# Altium project Wuerfel.PrjPcb
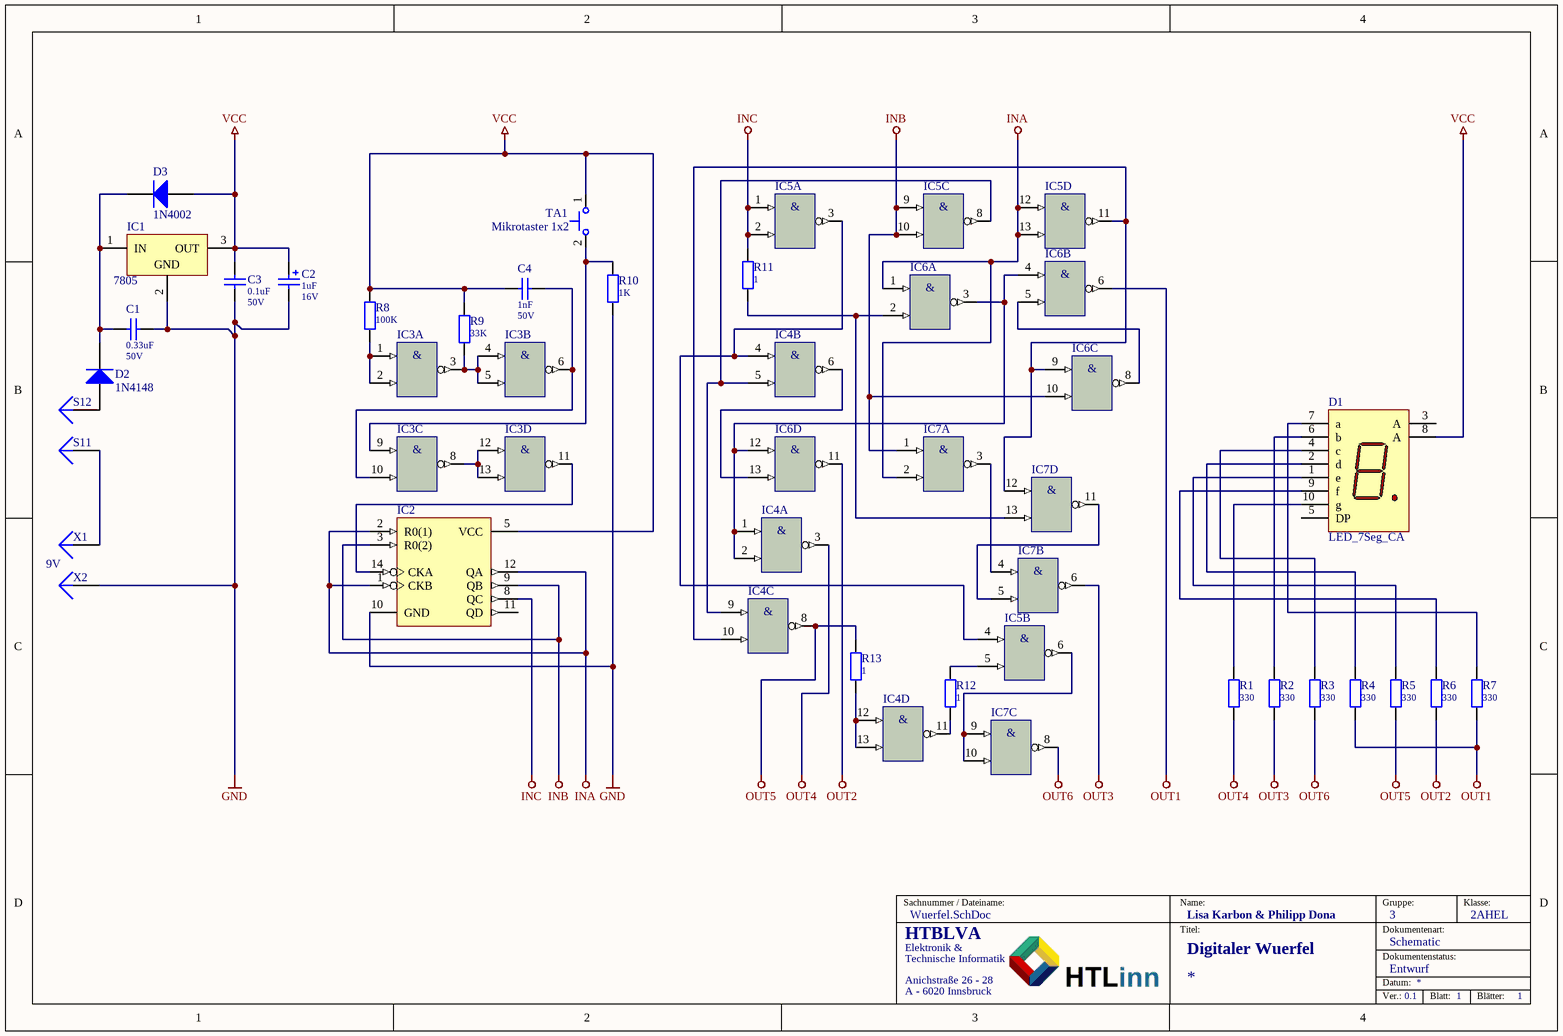
[diagram p0: Wuerfel.SchDoc]
1 sheet, 32 parts. Net scope: global (net labels, ports and power ports of the same name join across sheets).
Board file: Wuerfel.PcbDoc

## Sheet Wuerfel.SchDoc
size A4; DocumentNumber: 1; Revision: 0.1; SheetNumber: 1; SheetTotal: 1; HTL_Gruppe: 3; HTL_Klasse: 2AHEL; HTL_Schueler_Name: Lisa Karbon & Philipp Dona; PageSetup: Record=PageOptions|CenterHorizontal=True|CenterVertical=True|PrintScale=1.00|XCorrection=1.00|YCorrection=1.00|PrintKind=0|BorderSize=5000000|LeftOffset=0|BottomOffset=0|Orientation=2|PaperLength=1000|PaperWidth=1000|Scale=100|PaperSource=7|PrintQuality=-4|MediaType=1|DitherType=10|PaperKind=A4|PrintScaleMode=1; HTL_Projektname: Digitaler Wuerfel; HTL_Dokumentenart: Schematic; HTL_Dokumentenstatus: Entwurf; SPICEModelCacheRWURBHBP: <root> / <DocumentId>RWURBHBP</DocumentId> / <CacheFrame Number="0"> / <Model Name="1n4148w" Kind="MDL"> / <Text>******************************************************************************************************* / * / *                (c)  2009 Diodes Incorporated / * / *   The copyright in these models  and  the designs embodied belong / *   to Diodes Incorporated (" Diodes ").  They  are  supplied / *   free of charge by Diodes for the purpose of research and design / *   and may be used or copied intact  (including this notice)  for / *   that purpose only.  All other rights are reserved. The models / *   are believed accurate but  no condition  or warranty  as to their / *   merchantability or fitness for purpose is given and no liability / *   in respect of any use is accepted by Diodes Incorporated, its distributors / *   or agents. / * / *   Diodes Incorporated, 1566 N. Dallas Parkway, Suite 850, Dallas, TX 75248, USA / * / *************************************************************************************************************************************** / *SRC=1N4148W;1N4148W;Diodes;Si;  75.0V  0.300A  4.00ns   Diodes Inc. / .MODEL 1N4148W D  ( IS=10.4n RS=51.5m BV=75.0 IBV=1.00u / + CJO=2.00p  M=0.333 N=2.07 TT=5.76n )</Text> / </Model> / <Model Name="sn74ls93" Kind="MDL"> / <Text>*Texas Instruments / *SN74LS93: 4-Bit Binary Counter / .MODEL SN74LS93 xsimcode(file="{MODEL_PATH}LS.SCB" func=ls93 {mntymx})</Text> / </Model> / <Model Name="sn74ls00" Kind="MDL"> / <Text>*Texas Instruments / *SN74LS00: LS 2-in NAND / .MODEL SN74LS00 xsimcode(file="{MODEL_PATH}LS.SCB" func=ls00 {mntymx})</Text> / </Model> / <Model Name="di_1n4002" Kind="MDL"> / <Text>*************************************************************************************************************************************** / *SRC=1N4002;DI_1N4002;Diodes;Si;  100V  1.00A  3.00us   Diodes, Inc. diode / .MODEL DI_1N4002 D  ( IS=76.9p RS=42.0m BV=100 IBV=5.00u / + CJO=39.8p  M=0.333 N=1.45 TT=4.32u )</Text> / </Model> / </CacheFrame> / </root>

### Parts
C1  Rated Voltage: 50V  [C_RM2-025X075]  (hidden comment: 0.33uF)
C2  Rated Voltage: 16V  [C_POL_RM2-8,5]  (hidden comment: 1uF)
C3  Rated Voltage: 50V  [C_RM2-025X075]  (hidden comment: 0.1uF)
C4  Rated Voltage: 50V  [C_RM2-025X075]  (hidden comment: 1nF)
D1  LED_7Seg_CA  [LED_7Seg]
D2  1N4148  [D_DO35-RM3]
D3  1N4002  [D_DO41-RM4]
IC1  7805  [TO-220]
IC2  SN74LS93  [DIP14]  (value not drawn)
IC3  SN74LS00  [DIP14]  (value not drawn)  (parts A,B,C,D of 4)
IC4  SN74LS00  [DIP14]  (value not drawn)  (parts A,B,C,D of 4)
IC5  SN74LS00  [DIP14]  (value not drawn)  (parts A,B,C,D of 4)
IC6  SN74LS00  [DIP14]  (value not drawn)  (parts A,B,C,D of 4)
IC7  SN74LS00  [DIP14]  (value not drawn)  (parts A,B,C,D of 4)
R1  330  [R_0207/RM4]
R2  330  [R_0207/RM4]
R3  330  [R_0207/RM4]
R4  330  [R_0207/RM4]
R5  330  [R_0207/RM4]
R6  330  [R_0207/RM4]
R7  330  [R_0207/RM4]
R8  value 100K  [R_0207/RM4]  (hidden comment: 68K)
R9  33K  [R_0207/RM4]
R10  1K  [R_0207/RM4]
R11  1  [R_0207/RM4]
R12  1  [R_0207/RM4]
R13  1  [R_0207/RM4]
S11  Plug  [PIN1]  (value not drawn)
S12  Plug  [PIN1]  (value not drawn)
TA1  Mikrotaster 1x2  [SW_DTSM-61NT/R - 1x2]
X1  Plug  [PIN1]  (value not drawn)
X2  Plug  [PIN1]  (value not drawn)

### Nets
GND: C1.1 C2.2(-) C3.2 IC1.2(GND) IC2.10(GND) IC3.7(GND) IC4.7(GND) IC5.7(GND) IC6.7(GND) IC7.7(GND) R10.1 X2.1
INA: IC2.1(CKB) IC2.2(R0(1)) IC2.12(QA) IC5.12(A) IC5.13(B) IC6.1(A) IC7.2(B)
INB: IC2.3(R0(2)) IC2.9(QB) IC5.9(A) IC5.10(B) IC6.10(B) IC7.1(A)
INC: IC2.8(QC) IC5.1(A) IC5.2(B) R11.2
OUT1: IC6.6(Y) R4.1 R7.1
OUT2: IC6.11(Y) R6.1
OUT3: IC7.6(Y) R2.1
OUT4: IC4.3(Y) R1.1
OUT5: IC4.8(Y) R5.1 R13.2
OUT6: IC7.8(Y) R3.1
VCC: C2.1(+) C3.1 C4.1 D1.8(A) D3.A IC1.3(OUT) IC2.5(VCC) IC3.14(VCC) IC4.14(VCC) IC5.14(VCC) IC6.14(VCC) IC7.14(VCC) R8.1 R9.1 TA1.1
NetC1_2: C1.2 D2.C(K) D3.C(K) IC1.1(IN)
NetC4_2: C4.2 IC3.6(Y) IC3.10(B)
NetD1_1: D1.1(e) R5.2
NetD1_2: D1.2(d) R4.2
NetD1_4: D1.4(c) R3.2
NetD1_6: D1.6(b) R2.2
NetD1_7: D1.7(a) R7.2
NetD1_9: D1.9(f) R6.2
NetD1_10: D1.10(g) R1.2
NetD2_A: D2.A S12.1
NetIC2_14: IC2.14(CKA) IC3.11(Y)
NetIC3_1: IC3.1(A) IC3.2(B) R8.2
NetIC3_3: IC3.3(Y) IC3.4(A) IC3.5(B) R9.2
NetIC3_8: IC3.8(Y) IC3.12(A) IC3.13(B)
NetIC3_9: IC3.9(A) R10.2 TA1.2
NetIC4_1: IC4.1(A) IC4.2(B) IC6.3(Y) IC6.4(A) IC6.12(A)
NetIC4_4: IC4.4(A) IC5.3(Y) IC5.4(A)
NetIC4_5: IC4.5(B) IC4.9(A) IC5.8(Y)
NetIC4_6: IC4.6(Y) IC6.13(B)
NetIC4_10: IC4.10(B) IC5.11(Y) IC6.9(A) IC7.12(A)
NetIC4_11: IC4.11(Y) R12.2
NetIC4_12: IC4.12(A) IC4.13(B) R13.1
NetIC5_5: IC5.5(B) R12.1
NetIC5_6: IC5.6(Y) IC7.9(A) IC7.10(B)
NetIC6_2: IC6.2(B) IC7.13(B) R11.1
NetIC6_5: IC6.5(B) IC6.8(Y)
NetIC7_3: IC7.3(Y) IC7.4(A)
NetIC7_5: IC7.5(B) IC7.11(Y)
NetS11_1: S11.1 X1.1

Not connected (* = marked no-connect by the designer): D1 3(A) 5(DP); IC2 11(QD)

### Notes on the sheet
- 9V
- Sachnummer / Dateiname:
- Name:
- Gruppe:
- Klasse:
- Elektronik &
- Technische Informatik
- Anichstraße 26 - 28
- HTBLVA
- Titel:
- Datum:
- Dokumentenart:
- Dokumentenstatus:
- A - 6020 Innsbruck
- Ver.:
- Blatt:
- Blätter:
- (in symbol SN74LS00, part A) &
- (in symbol SN74LS00, part B) &
- (in symbol SN74LS00, part C) &
- (in symbol SN74LS00, part D) &

### Library data of the parts
C1 C3 C4 = C: Capacitor; Usage: only permitted for non-commercial purposes at HTL I Innsbruck; Published: 21-Feb-2011; LatestRevisionDate: 07-Sep-2019
  C1: Value: 0.33uF
  C3: Value: 0.1uF
  C4: Value: 1nF
C2 = C_POL: Polarized Capacitor; Usage: only permitted for non-commercial purposes at HTL I Innsbruck; Published: 21-Feb-2011; LatestRevisionDate: 07-Sep-2019; Value: 1uF
D1 = LED_7Seg_CA: Red 7-Segment Display, CA, 13 mm Slim Font; SimulationModellSource: currently not available; Usage: only permitted for non-commercial purposes at HTL I Innsbruck; Published: 21-Sep-2017; LatestRevisionDate: 21-Sep-2017
D2 = 1N4148: Si-Diode; 75V, 0.300A, 4.00ns (Diodes Inc.); Usage: only permitted for non-commercial purposes at HTL I Innsbruck; SimulationModellSource: Diodes Incorporated; Published: 21-Feb-2011; LatestRevisionDate: 01-Nov-2012
D3 = 1N4002: Si-Diode; 100V, 1.00A, 3.00us (Diodes, Inc.); Usage: only permitted for non-commercial purposes at HTL I Innsbruck; SimulationModellSource: Diodes Incorporated; Published: 21-Feb-2011; LatestRevisionDate: 01-Nov-2012
IC1 = 78xx: Positive-Voltage Regulator; SimulationModellSource: <no Sim-Modell found so far>; Usage: only permitted for non-commercial purposes at HTL I Innsbruck; Published: 21-Feb-2011; LatestRevisionDate: 31-Oct-2012
IC2 = SN74LS93: 4-Bit Binary Counter; Usage: only permitted for non-commercial purposes at HTL I Innsbruck; SimulationModellSource: TI Logic Counter; Published: 21-Feb-2011; LatestRevisionDate: 31-Oct-2012
IC3-IC7 = SN74LS00: Quad 2-Input Positive-NAND Gate; SimulationModellSource: TI Logic Gate 2; Usage: only permitted for non-commercial purposes at HTL I Innsbruck; Published: 21-Feb-2011; LatestRevisionDate: 31-Oct-2012; Publisher: Michael Kupfner
R1-R13 = R: Resistor; Usage: only permitted for non-commercial purposes at HTL I Innsbruck; Published: 21-Feb-2011; LatestRevisionDate: 07-Sep-2019
  R1-R7: Value: 330
  R9: Value: 33K
  R10: Value: 1K
  R11-R13: Value: 1
TA1 = Mikrotaster 1x2: Mikrotaster 1x2; max DC 50V; Usage: only permitted for non-commercial purposes at HTL I Innsbruck; SimulationModellSource: <No SimModell found so far>; Published: 29-Mar-2017; LatestRevisionDate: 07-Sep-2019; Publisher: Michael Kupfner
S11 S12 X1 X2 = Plug: LatestRevisionDate: 17-Jul-2002; LatestRevisionNote: Re-released for DXP Platform.; Publisher: Altium Limited